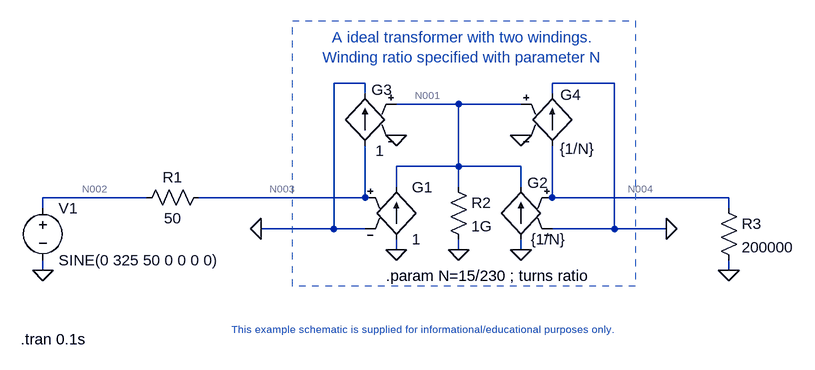
[diagram p0: schematic IdealTransformer.asc]
IdealTransformer.asc, the LTspice schematic file:
Version 4
SHEET 1 932 680
WIRE 160 0 112 0
WIRE 544 0 448 0
WIRE 160 16 160 0
WIRE 448 16 448 0
WIRE 304 32 208 32
WIRE 400 32 304 32
WIRE 304 128 304 32
WIRE 304 128 208 128
WIRE 400 128 304 128
WIRE 208 160 208 128
WIRE 304 160 304 128
WIRE 400 160 400 128
WIRE -176 176 -336 176
WIRE 160 176 160 96
WIRE 160 176 -96 176
WIRE 448 176 448 96
WIRE 720 176 448 176
WIRE -336 192 -336 176
WIRE 720 192 720 176
WIRE 112 224 112 0
WIRE 112 224 0 224
WIRE 160 224 112 224
WIRE 544 224 544 0
WIRE 544 224 448 224
WIRE 624 224 544 224
WIRE 208 256 208 240
WIRE 304 256 304 240
WIRE 400 256 400 240
WIRE -336 288 -336 272
WIRE 720 288 720 272
FLAG -336 288 0
FLAG 400 256 0
FLAG 208 256 0
FLAG 208 80 0
FLAG 400 80 0
FLAG 304 256 0
FLAG 0 224 0
FLAG 624 224 0
FLAG 720 288 0
SYMBOL voltage -336 176 R0
WINDOW 123 0 0 Left 0
WINDOW 39 0 0 Left 0
SYMATTR InstName V1
SYMATTR Value SINE(0 325 50 0 0 0 0)
SYMBOL res -80 160 R90
WINDOW 0 0 56 VBottom 2
WINDOW 3 32 56 VTop 2
SYMATTR InstName R1
SYMATTR Value 50
SYMBOL g 208 144 R0
SYMATTR InstName G1
SYMATTR Value 1
SYMBOL g 400 144 M0
WINDOW 0 -10 9 Right 2
WINDOW 3 -15 96 Right 2
SYMATTR InstName G2
SYMATTR Value {1/N}
SYMBOL g 160 0 M0
WINDOW 0 -10 10 Right 2
WINDOW 3 -16 104 Right 2
SYMATTR InstName G3
SYMATTR Value 1
SYMBOL g 448 0 R0
WINDOW 0 13 18 Left 2
WINDOW 3 12 101 Left 2
SYMATTR InstName G4
SYMATTR Value {1/N}
SYMBOL res 288 144 R0
SYMATTR InstName R2
SYMATTR Value 1G
SYMBOL res 704 176 R0
SYMATTR InstName R3
SYMATTR Value 200000
TEXT 240 368 Top 1 ;This example schematic is supplied for informational/educational purposes only.
TEXT 312 -24 Bottom 2 ;A ideal transformer with two windings.\nWinding ratio specified with parameter N
TEXT 192 296 Left 2 !.param N=15/230 ; turns ratio
TEXT -370 394 Left 2 !.tran 0.1s
RECTANGLE Normal 576 312 48 -96 2

The netlist it stands for:
* IdealTransformer.asc
V1 N002 0 SINE(0 325 50 0 0 0 0)
R1 N003 N002 50
G1 0 N001 N003 0 1
G2 0 N001 N004 0 {1/N}
G3 N003 0 N001 0 1
G4 N004 0 N001 0 {1/N}
R2 N001 0 1G
R3 N004 0 200000
* This example schematic is supplied for informational/educational purposes only.
* A ideal transformer with two windings.
* Winding ratio specified with parameter N
.param N=15/230 ; turns ratio
.tran 0.1s
.backanno
.end

* Results of the author's LTspice run, read from the files saved beside the schematic
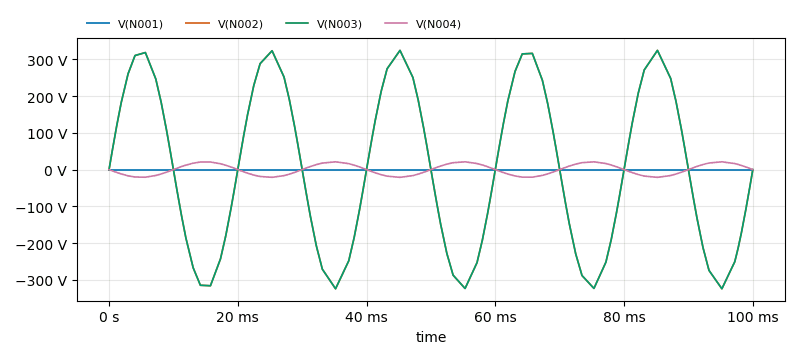
[diagram p1: Transient Analysis of IdealTransformer.asc, plotted from the saved traces]
* Transient Analysis, 1 run:
*   V(N001): min -6.891 µV, max 6.891 µV, average 1.789 nV, rms 4.811 µV, last 0 V
*   V(N002): min -324.1 V, max 324.1 V, average 84.14 mV, rms 226.3 V, last 0 V
*   V(N003): min -324 V, max 324 V, average 84.12 mV, rms 226.2 V, last 0 V
*   V(N004): min -21.13 V, max 21.13 V, average -5.486 mV, rms 14.75 V, last 0 V